# Altium project buzzerWithBattery.PrjPcb
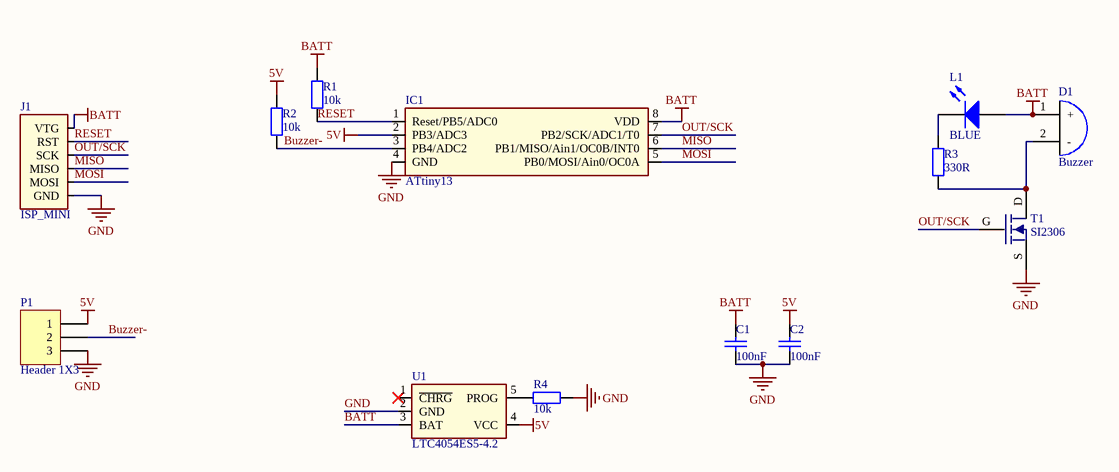
[diagram p0: buzzerWithBattery.SchDoc]
1 sheet, 13 parts. Net scope: global (net labels, ports and power ports of the same name join across sheets).
Board file: buzzerWithBattery.PcbDoc

## Sheet buzzerWithBattery.SchDoc
size A4; CompanyName: iData Kft.; Organization: iData Kft.; Address1: 1103 Budapest; Address2: Gergely utca 112/C; Revision: 2.0; ProductionState: Prototype

### Parts
C1  100nF  [FP_0603_CAP_080]
C2  100nF  [FP_0603_CAP_080]
D1  Buzzer  [Buzzer_MBS12XXX]
IC1  ATtiny13  [DIGITAL_SOIC8_WSON]
J1  ISP_MINI  [AVR_ISP_MINI]  (no BOM)
L1  BLUE  [FP_0603_LED_B]
P1  Header 1X3  [HEADER_2.54MM_M_1x3]
R1  10k  [FP_0603_RES]
R2  10k  [FP_0603_RES]
R3  330R  [FP_0603_RES]
R4  10k  [FP_0603_RES]
T1  SI2306  [FET_SOT23]
U1  LTC4054ES5-4.2  [SUPPLY_SOT23-5]

### Nets
5V: C2.2 IC1.2(PB3/ADC3) P1.1 R2.2 U1.4(VCC)
BATT: C1.2 D1.1(+) IC1.8(VDD) J1.1(VTG) L1.A R1.2 U1.3(BAT)
GND: C1.1 C2.1 IC1.4(GND) J1.6(GND) P1.3 R4.2 T1.S U1.2(GND)
Buzzer-: IC1.3(PB4/ADC2) P1.2 R2.1
MISO: IC1.6(PB1/MISO/Ain1/OC0B/INT0) J1.4(MISO)
MOSI: IC1.5(PB0/MOSI/Ain0/OC0A) J1.5(MOSI)
OUT/SCK: IC1.7(PB2/SCK/ADC1/T0) J1.3(SCK) T1.G
RESET: IC1.1(Reset/PB5/ADC0) J1.2(RST) R1.1
NetD1_2: D1.2(-) R3.2 T1.D
NetL1_K: L1.K R3.1
NetR4_1: R4.1 U1.5(PROG)

Not connected (* = marked no-connect by the designer): U1 1(~{CHRG})*

### Notes on the sheet
- Project:
- Sheet Name:
- iData Kft.
- 1103 Budapest
- Gergely utca 112/C
- Modified:
- Revision:

### Library data of the parts
C1 C2 = CAP: Capacitor; Part number: 100nF_0603_50V_X7R_10percent; Value: 100nF; Sample: 82-12-71
L1 = LED_B: Typical LED; Part number: Blue_Led_0603; Sample: 95-02-47
P1 = Header 1X3: Header, 3-Pin; LatestRevisionDate: 17-Jul-2002; LatestRevisionNote: Re-released for DXP Platform.; Publisher: Altium Limited
R1 R2 R4 = Res3: Resistor; Part number: 10k_0603_1percent; Value: 10k; Sample: 80-15-13
R3 = RES: Resistor; Part number: 330R_0603_1percent; Value: 330R; Sample: 80-19-19
T1 = NMOS: Leírás: N-POWERFET 30V 4A Rds=0.047R; Part number: SI2306; Sample: 86-01-57
U1 = LTC4054ES5-4.2: LiPo charger 800mA
D1 = Buzzer: Part number: *; Sample: *